# Altium schematic sheet Power.SchDoc
size A4
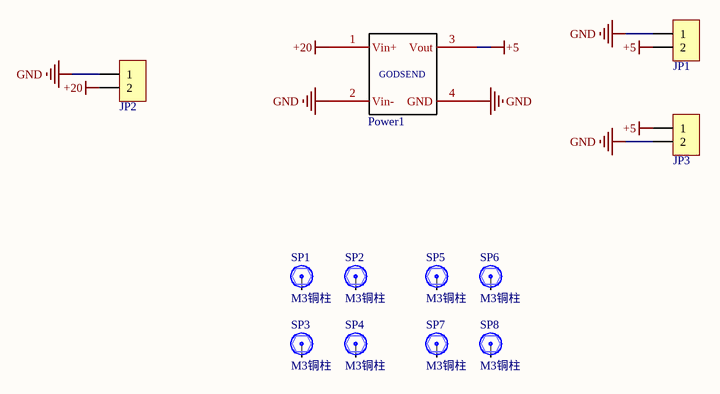
[diagram p0: Power.SchDoc]

## Parts
JP1  HDR-1X2  [KF301-5.0-2P]  (value not drawn)
JP2  HDR-1X2  [KF301-5.0-2P]  (value not drawn)
JP3  HDR-1X2  [KF301-5.0-2P]  (value not drawn)
Power1  GODSEND  [GODSEND]  (value not drawn)
SP1  M3铜柱  [M3x10_L]
SP2  M3铜柱  [M3x10_L]
SP3  M3铜柱  [M3x10_L]
SP4  M3铜柱  [M3x10_L]
SP5  M3铜柱  [M3x10_L]
SP6  M3铜柱  [M3x10_L]
SP7  M3铜柱  [M3x10_L]
SP8  M3铜柱  [M3x10_L]

## Nets
+5: JP1.2 JP3.1 Power1.3(Vout)
+20: JP2.2 Power1.1(Vin+)
GND: JP1.1 JP2.1 JP3.2 Power1.2(Vin-) Power1.4(GND)

Not connected (* = marked no-connect by the designer): SP1 1; SP2 1; SP3 1; SP4 1; SP5 1; SP6 1; SP7 1; SP8 1

## Library data of the parts
JP1-JP3 = Header 2: 2P接插件; 版权归属: 源创客; BOM名称: 2P接插件; 学习资源: www.ooocke.com
Power1 = GODSEND: pin to pad: 1>2 2>1 3>4 4>3
SP1-SP8 = 铜柱小焊盘: 铜柱; 版权归属: 源创客; BOM名称: 铜柱; 学习资源: www.ooocke.com